# Altium schematic sheet Sheet2.SchDoc
size A; SheetNumber: 3; SheetTotal: 6
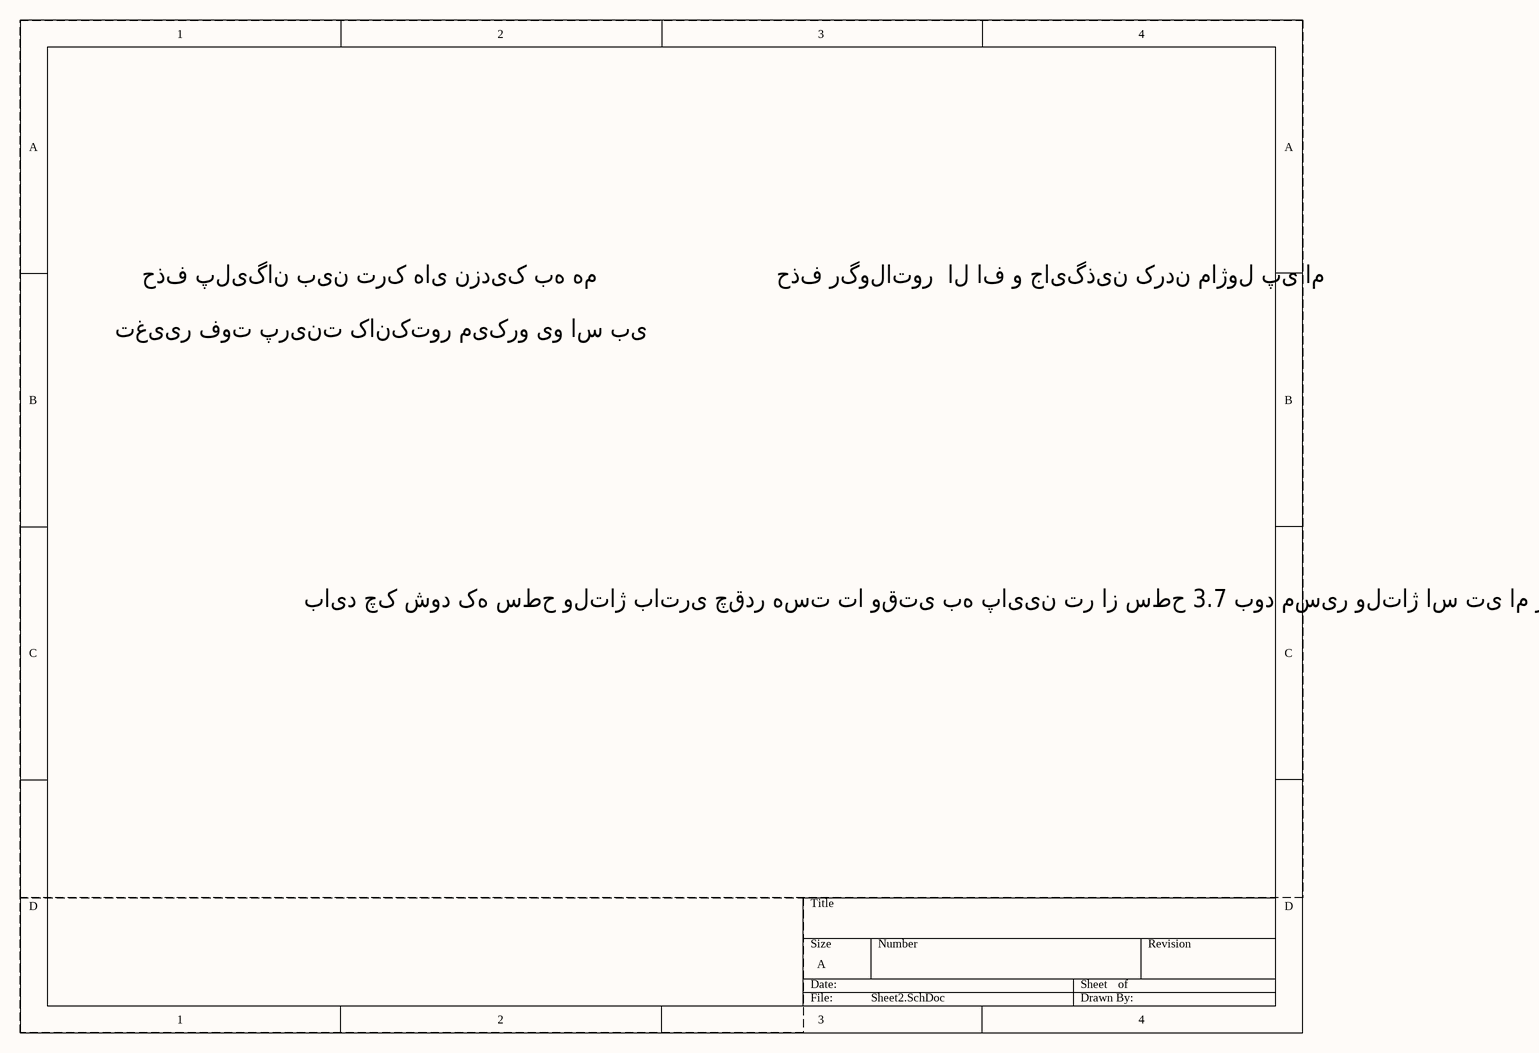
[diagram p0: Sheet2.SchDoc]

## Notes on the sheet
- حذف پلیگان بین ترک های نزدیک به هم
- حذف رگولاتور  ال اف و جایگذین کردن ماژول پی ام
- تغییر فوت پرینت کانکتور میکرو یو اس بی
- باید چک شود که سطح ولتاژ باتری چقدر هست تا وقتی به پایین تر از سطح 3.7 بود مسیر ولتاژ اس تی ام رو قطع کند